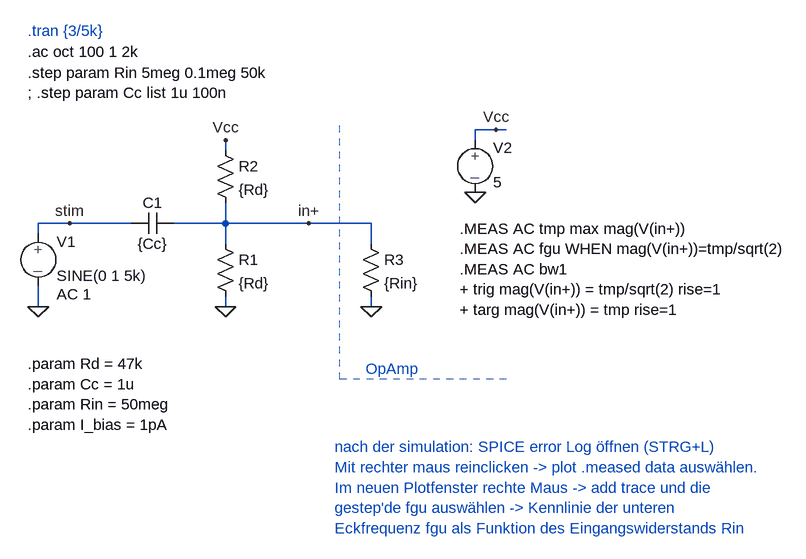
[diagram p0: schematic ac_couple.asc]
ac_couple.asc, the LTspice schematic file:
Version 4
SHEET 1 1928 1492
WIRE 640 32 608 32
WIRE 656 32 640 32
WIRE 608 48 608 32
WIRE 224 64 224 48
WIRE -16 176 -64 176
WIRE 80 176 -16 176
WIRE 224 176 224 144
WIRE 224 176 144 176
WIRE 352 176 224 176
WIRE 448 176 352 176
WIRE -64 192 -64 176
WIRE 224 208 224 176
WIRE 448 208 448 176
WIRE -64 304 -64 272
WIRE 224 304 224 288
WIRE 448 304 448 288
FLAG -64 304 0
FLAG 224 304 0
FLAG 608 128 0
FLAG 640 32 Vcc
FLAG 224 48 Vcc
FLAG 448 304 0
FLAG 352 176 in+
FLAG -16 176 stim
SYMBOL res 208 192 R0
SYMATTR InstName R1
SYMATTR Value {Rd}
SYMBOL res 208 48 R0
SYMATTR InstName R2
SYMATTR Value {Rd}
SYMBOL cap 144 160 R90
WINDOW 0 0 32 VBottom 2
WINDOW 3 32 32 VTop 2
SYMATTR InstName C1
SYMATTR Value {Cc}
SYMBOL source-V -64 176 R0
WINDOW 123 28 109 Left 2
WINDOW 39 0 0 Left 2
SYMATTR Value2 AC 1
SYMATTR InstName V1
SYMATTR Value SINE(0 1 5k)
SYMBOL source-V 608 32 R0
WINDOW 123 0 0 Left 2
WINDOW 39 0 0 Left 2
SYMATTR InstName V2
SYMATTR Value 5
SYMBOL res 432 192 R0
SYMATTR InstName R3
SYMATTR Value {Rin}
TEXT -80 392 Left 2 !.param Rd = 47k\n.param Cc = 1u\n.param Rin = 50meg\n.param I_bias = 1pA
TEXT 440 400 Left 2 ;OpAmp
TEXT -80 -120 Left 2 ;.tran {3/5k}
TEXT -80 -88 Left 2 !.ac oct 100 1 2k
TEXT 584 184 Left 2 !.MEAS AC tmp max mag(V(in+))\n.MEAS AC fgu WHEN mag(V(in+))=tmp/sqrt(2)\n.MEAS AC bw1\n+ trig mag(V(in+)) = tmp/sqrt(2) rise=1\n+ targ mag(V(in+)) = tmp rise=1
TEXT -80 -56 Left 2 !.step param Rin 5meg 0.1meg 50k\n; .step param Cc list 1u 100n
TEXT 392 520 Left 2 ;nach der simulation: SPICE error Log öffnen (STRG+L) \nMit rechter maus reinclicken -> plot .meased data auswählen.\nIm neuen Plotfenster rechte Maus -> add trace und die \ngestep'de fgu auswählen -> Kennlinie der unteren \nEckfrequenz fgu als Funktion des Eingangswiderstands Rin
LINE Normal 400 416 400 16 2
LINE Normal 656 416 400 416 2

The netlist it stands for:
* ac_couple.asc
R1 in+ 0 {Rd}
R2 Vcc in+ {Rd}
C1 in+ stim {Cc}
V1 stim 0 SINE(0 1 5k) AC 1
V2 Vcc 0 5
R3 in+ 0 {Rin}
.param Rd = 47k
.param Cc = 1u
.param Rin = 50meg
.param I_bias = 1pA
* OpAmp
* .tran {3/5k}
.ac oct 100 1 2k
.MEAS AC tmp max mag(V(in+))
.MEAS AC fgu WHEN mag(V(in+))=tmp/sqrt(2)
.MEAS AC bw1
+ trig mag(V(in+)) = tmp/sqrt(2) rise=1
+ targ mag(V(in+)) = tmp rise=1
.step param Rin 5meg 0.1meg 50k
; .step param Cc list 1u 100n
* nach der simulation: SPICE error Log öffnen (STRG+L)
* Mit rechter maus reinclicken -> plot .meased data auswählen.
* Im neuen Plotfenster rechte Maus -> add trace und die
* gestep'de fgu auswählen -> Kennlinie der unteren
* Eckfrequenz fgu als Funktion des Eingangswiderstands Rin
.backanno
.end